# EAGLE design esp8266 - velky stabilizator (EAGLE 9.6.2)
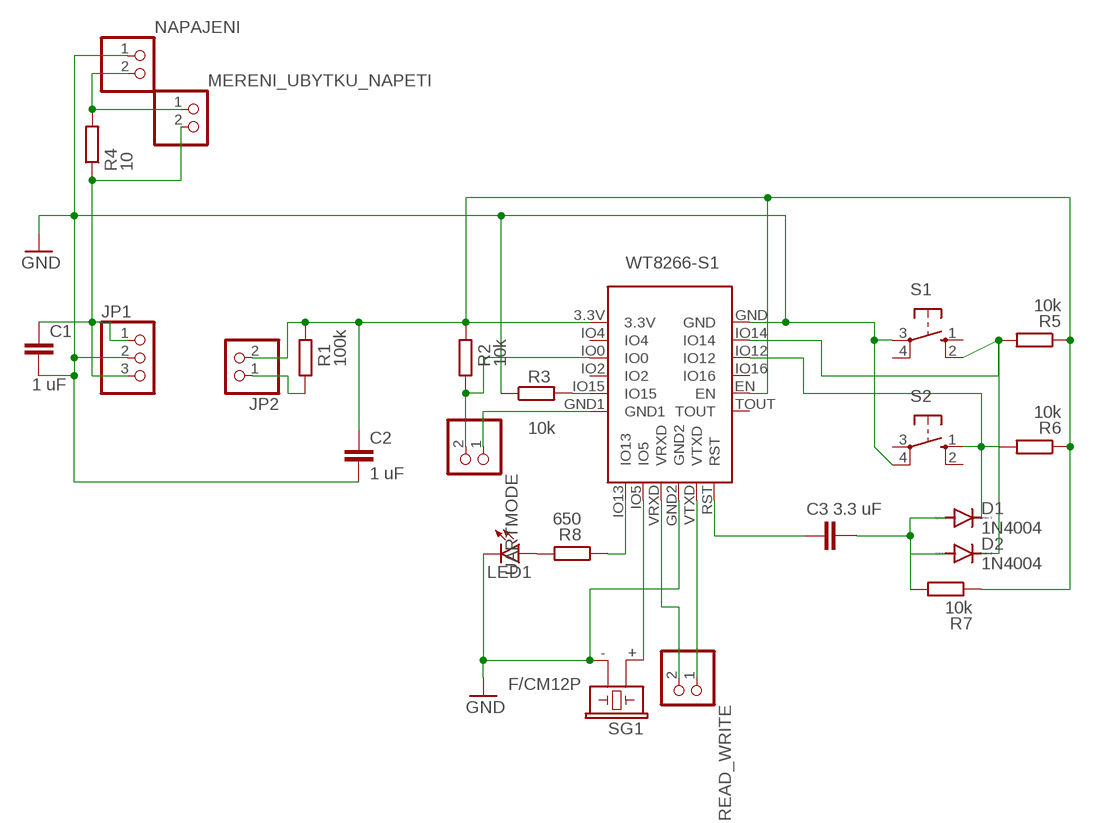
[diagram p0: schematic, sheet 1]

## Parts
C1  1 uF  C2.5/2  [C2.5-2]
C2  1 uF  C2.5/2  [C2.5-2]
C3  3.3 uF  C2.5/2  [C2.5-2]
D1  1N4004  [DO41-10]
D2  1N4004  [DO41-10]
JP1  PINHD-1X3  [1X03]
JP2  PINHD-1X2  [1X02]
LED1  LED5MM  [LED5MM]
MERENI_UBYTKU_NAPETI  PINHD-1X2  [1X02]
NAPAJENI  PINHD-1X2  [1X02]
R1  100k  R-EU_0207/10  [0207/10]
R2  10k  R-EU_0207/10  [0207/10]
R3  10k  R-EU_0207/10  [0207/10]
R4  10  R-EU_0207/10  [0207/10]
R5  10k  R-EU_0207/10  [0207/10]
R6  10k  R-EU_0207/10  [0207/10]
R7  10k  R-EU_0207/10  [0207/10]
R8  650  R-EU_0207/10  [0207/10]
READ_WRITE  PINHD-1X2  [1X02]
S1  10-XX  [B3F-10XX]
S2  10-XX  [B3F-10XX]
SG1  F/CM12P  [F/CM12P]
U$1  WT8266-S1  [WT8266-S1]
UARTMODE  PINHD-1X2  [1X02]

## Nets
GND: C1.2 C2.2 JP1.2 LED1.K(C) NAPAJENI.1 R3.1 S1.3(P) S2.4(P1) SG1.- U$1.GND U$1.GND2
N$1: C1.1 JP1.1 JP1.3 MERENI_UBYTKU_NAPETI.2 R4.1
N$2: C2.1 JP2.2 R1.2 R2.2 R5.1 R6.1 R7.1 U$1.3.3V U$1.EN
N$3: R2.1 U$1.IO0 UARTMODE.2
N$4: JP2.1 R1.1
N$5: READ_WRITE.2 U$1.VRXD
N$7: READ_WRITE.1 U$1.VTXD
N$8: U$1.GND1 UARTMODE.1
N$9: R3.2 U$1.IO15
N$10: MERENI_UBYTKU_NAPETI.1 NAPAJENI.2 R4.2
N$11: C3.1 U$1.RST
N$12: D1.C R6.2 S2.1(S) U$1.IO12
N$13: D2.C R5.2 S1.2(S1) U$1.IO14
N$14: C3.2 D1.A D2.A R7.2
N$15: R8.1 U$1.IO13
N$16: LED1.A R8.2
N$17: SG1.+ U$1.IO5
Unconnected: S1.1(S) S1.4(P1) S2.2(S1) S2.3(P) U$1.IO2 U$1.IO4 U$1.IO16 U$1.TOUT

## Library data of the parts
C1-C3 = capacitor-wima:C: CAPACITOR naming: grid - package width
D1 D2 = diode:1N4004: DIODE general purpose rectifier, 1 A
JP1 = pinhead:PINHD-1X3: PIN HEADER
JP2 MERENI_UBYTKU_NAPETI NAPAJENI READ_WRITE UARTMODE = pinhead:PINHD-1X2: PIN HEADER
LED1 = led:LED: LED OSRAM: - CHIPLED LG R971, LG N971, LY N971, LG Q971, LY Q971, LO R971, LY R971 LH N974, LH R974 LS Q976, LO Q976, LY Q976 LO Q996 - Hyper CHIPLED LW Q18S LB Q993, LB Q99A, LB R99A - SideLED LS A670, LO A670, LY A670, LG A670, LP A670 LB A673, LV A673, LT A673, LW A673 LH A674 LY A675 LS A676, LA A676, LO A676, LY A676, LW A676 LS A679, LY A679, LG A679 - Hyper Micro SIDELED® LS Y876, LA Y876, LO Y876, LY Y876 LT Y87S - SmartLED LW L88C, LW L88S LB L89C, LB L89S, LG L890 LS L89K, LO L89K, LY L89K LS L896, LA L896, LO L896, LY L896 - TOPLED LS T670, LO T670, LY T670, LG T670, LP T670 LSG T670, LSP T670, LSY T670, LOP T670, LYG T670 LG T671, LOG T671, LSG T671 LB T673, LV T673, LT T673, LW T673 LH T674 LS T676, LA T676, LO T676, LY T676, LB T676, LH T676, LSB T676, LW T676 LB T67C, LV T67C, LT T67C, LS T67K, LO T67K, LY T67K, LW E67C LS E67B, LA E67B, LO E67B, LY E67B, LB E67C, LV E67C, LT E67C LW T67C LS T679, LY T679, LG T679 LS T770, LO T770, LY T770, LG T770, LP T770 LB T773, LV T773, LT T773, LW T773 LH T774 LS E675, LA E675, LY E675, LS T675 LS T776, LA T776, LO T776, LY T776, LB T776 LHGB T686 LT T68C, LB T68C - Hyper Mini TOPLED® LB M676 - Mini TOPLED Santana® LG M470 LS M47K, LO M47K, LY M47K Source: http://www.osram.convergy.de LUXEON: - LUMILED® LXK2-PW12-R00, LXK2-PW12-S00, LXK2-PW14-U00, LXK2-PW14-V00 LXK2-PM12-R00, LXK2-PM12-S00, LXK2-PM14-U00 LXK2-PE12-Q00, LXK2-PE12-R00, LXK2-PE12-S00, LXK2-PE14-T00, LXK2-PE14-U00 LXK2-PB12-K00, LXK2-PB12-L00, LXK2-PB12-M00, LXK2-PB14-N00, LXK2-PB14-P00, LXK2-PB14-Q00 LXK2-PR12-L00, LXK2-PR12-M00, LXK2-PR14-Q00, LXK2-PR14-R00 LXK2-PD12-Q00, LXK2-PD12-R00, LXK2-PD12-S00 LXK2-PH12-R00, LXK2-PH12-S00 LXK2-PL12-P00, LXK2-PL12-Q00, LXK2-PL12-R00 Source: www.luxeon.com KINGBRIGHT: KA-3528ASYC Source: www.kingbright.com
R1-R8 = rcl:R-EU_: RESISTOR, European symbol; SPICEPREFIX: R
S1 S2 = switch-omron:10-XX: OMRON SWITCH; MPN: B3F-1000; OC_FARNELL: 176432; OC_NEWARK: 36M3542
SG1 = buzzer:F/CM12P: BUZZER Source: Buerklin; OC_FARNELL: unknown; OC_NEWARK: unknown
U$1 = WT8266:WT8266-S1

## Board
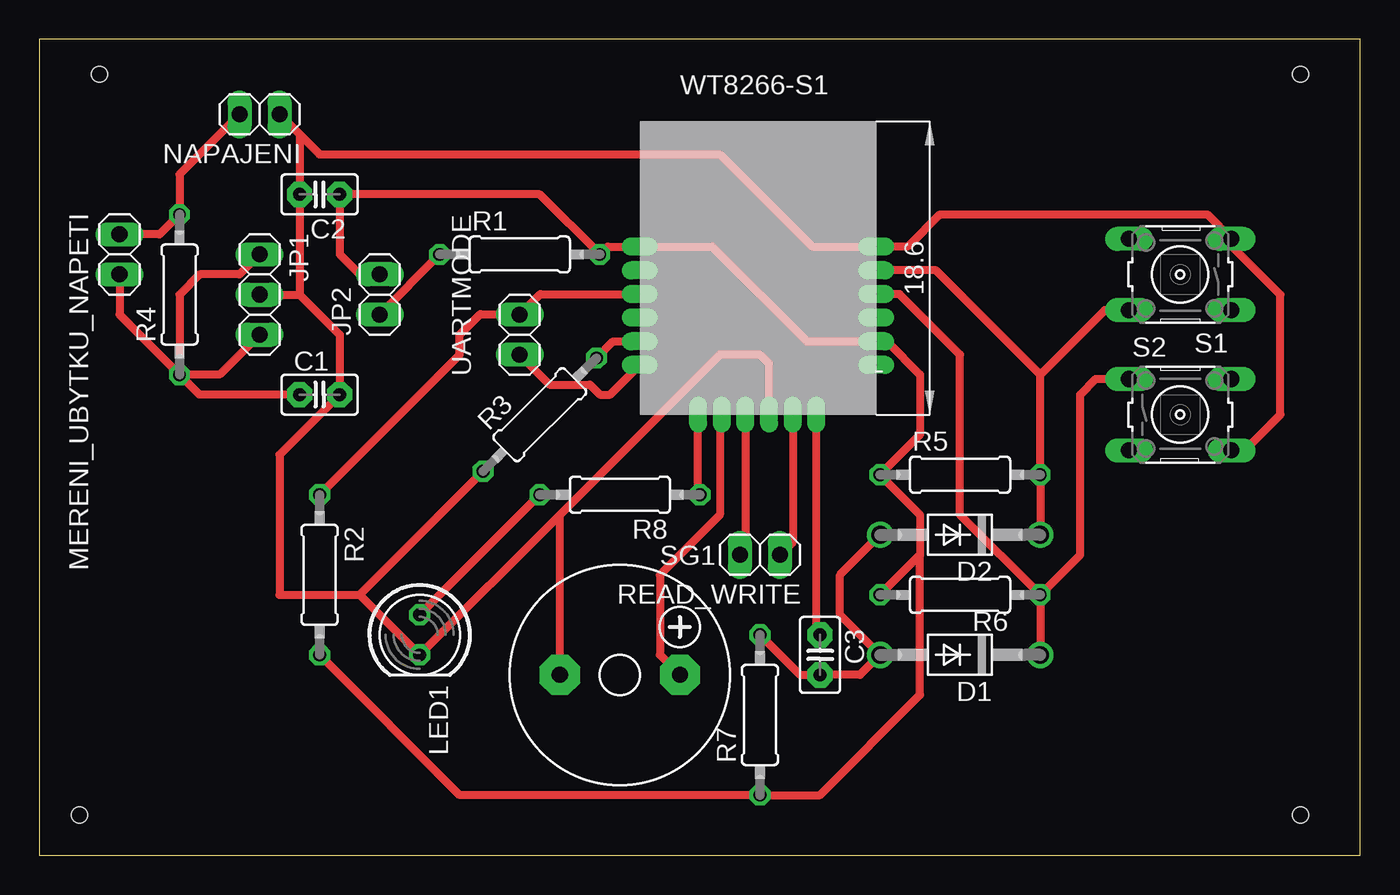
[diagram p1: board, top side]
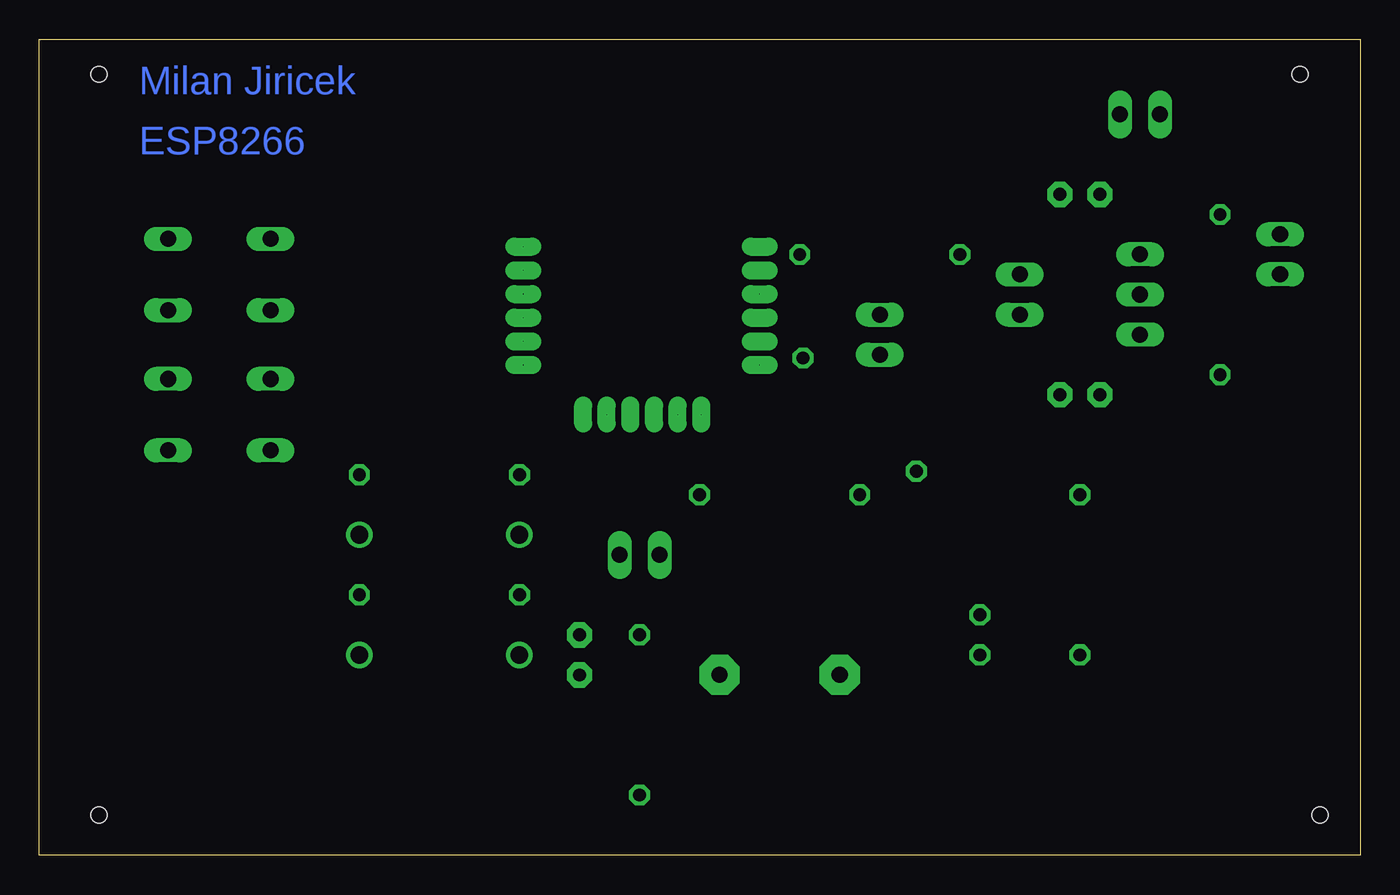
[diagram p2: board, bottom side, seen from below]

Size 83.8 x 51.74 mm. Coordinates in mm from the lower left corner, seen from the top.
Outline: 0,0 83.8,0 83.8,51.74 0,51.74 0,0
Copper layers (1*16): Top 0.035mm / dielectric 1.5mm / Bottom 0.035mm
Design rules "default": minimum track width 6mil, minimum drill 0.35mm, track to track 6mil, track to pad 6mil, pad to pad 6mil, via to via 6mil, smd to smd 6mil, copper to edge 40mil, drill to drill 6mil, minimum pad ring 10mil, minimum via ring 8mil, stop-mask expansion 4mil, vias tented up to drill 0mil, thermal gap 10mil
Holes 1 mm at 2.54,2.54 80.01,2.54 80.01,49.53 3.81,49.53

### Footprints (pad centres in the part's own frame; a part is rotated, then mirrored left to right if it is on the bottom)
C2.5-2 = drill 0.813 pad 1.6 octagon: 1 -1.27,0; 2 1.27,0
DO41-10 = drill 1.118: A 5.08,0; C -5.08,0
1X03 = drill 1.016 long: 1 -2.54,0; 2 0,0; 3 2.54,0
1X02 = drill 1.016 long: 1 -1.27,0; 2 1.27,0
LED5MM = drill 0.813 octagon: A -1.27,0; K 1.27,0
0207/10 = drill 0.813 octagon: 1 -5.08,0; 2 5.08,0
B3F-10XX = drill 1.016 long: 1 -3.251,2.261; 2 3.251,2.261; 3 -3.251,-2.261; 4 3.251,-2.261
F/CM12P = drill 1.016 pad 2.54 octagon: + 3.81,0; - -3.81,0
WT8266-S1 = drill 0.01 pad 1.143 long: 3.3V 0,10.65; EN 15,4.65; GND 15,10.65; GND1 0,3.15; GND2 8.2,0; IO0 0,7.65; IO2 0,6.15; IO4 0,9.15; IO5 5.2,0; IO12 15,7.65; IO13 3.7,0; IO14 15,9.15; IO15 0,4.65; IO16 15,6.15; RST 11.2,0; TOUT 15,3.15; VRXD 6.7,0; VTXD 9.7,0

### Placement (x,y rotation side)
C1  17.78,29.21 0 top
C2  17.78,41.91 180 top
C3  49.53,12.7 270 top
D1  58.42,12.7 180 top
D2  58.42,20.32 180 top
JP1  13.97,35.56 270 top
JP2  21.59,35.56 90 top
LED1  24.13,13.97 270 top
MERENI_UBYTKU_NAPETI  5.08,38.1 270 top
NAPAJENI  13.97,46.99 180 top
R1  30.48,38.1 0 top
R2  17.78,17.78 270 top
R3  31.75,27.94 45 top
R4  8.89,35.56 90 top
R5  58.42,24.13 0 top
R6  58.42,16.51 0 top
R7  45.72,8.89 90 top
R8  36.83,22.86 180 top
READ_WRITE  45.72,19.05 180 top
S1  72.39,36.83 180 top
S2  72.39,27.94 0 top
SG1  36.83,11.43 0 top
U$1  38.1,27.94 0 top
UARTMODE  30.48,33.02 90 top

### Tracks (layer width: path | path; a pad name or v marks a point on that pad's centre or on a via)
GND
  Top 0.508: S2.4 76.48,25.68 78.74,27.94 78.74,35.56 75.64,38.66 S1.3 74.09,40.64 57.15,40.64 55.1,38.59 U$1.GND 49.04,38.59 43.18,44.45 17.78,44.45 NAPAJENI.1 16.51,45.72 C2.2 16.51,35.56 | 20.32,16.51 15.24,16.51 15.24,25.4 C1.2 19.05,33.02 16.51,35.56 | R3.1 20.32,16.51 | JP1.2 16.51,35.56 | SG1.- 33.02,21.59 | 33.02,21.59 LED1.K 20.32,16.51 | U$1.GND2 46.3,31.17 45.72,31.75 43.18,31.75 33.02,21.59
N$1
  Top 0.508: R4.1 5.08,34.29 MERENI_UBYTKU_NAPETI.2 | C1.1 10.16,29.21 R4.1 | JP1.3 11.43,30.48 R4.1 | JP1.1 12.7,36.83 10.16,36.83 8.89,35.56 R4.1
N$2
  Top 0.508: 19.11,41.85 C2.1 | 55.88,19.05 R6.1 | 55.88,19.05 55.88,21.59 R5.1 55.88,26.67 55.88,30.48 53.77,32.59 U$1.EN 48.69,32.59 42.69,38.59 U$1.3.3V 36.05,38.59 R1.2 31.75,41.91 C2.1 | 55.88,19.05 55.88,10.16 49.53,3.81 R7.1 26.67,3.81 R2.2 | C2.1 19.05,38.1 20.32,36.83 JP2.2
N$3
  Top 0.508: R2.1 26.67,31.75 26.67,33.02 27.97,34.32 30.51,34.32 UARTMODE.2 31.78,35.59 U$1.IO0
N$4
  Top 0.508: JP2.1 R1.1
N$5
  Top 0.508: U$1.VRXD 44.8,19.4 READ_WRITE.2
N$7
  Top 0.508: U$1.VTXD 47.8,19.86 READ_WRITE.1
N$8
  Top 0.508: UARTMODE.1 32.38,29.84 | 32.38,29.84 32.41,29.82 | 32.38,29.84 34.92,29.84 35.56,29.21 36.22,29.21 U$1.GND1
N$9
  Top 0.508: 35.55,31.32 R3.2 36.4,32.59 U$1.IO15
N$10
  Top 0.508: NAPAJENI.2 8.89,43.18 R4.2 7.62,39.37 MERENI_UBYTKU_NAPETI.1
N$11
  Top 0.508: C3.1 49.3,14.2 U$1.RST
N$12
  Top 0.508: R6.2 D1.C | R6.2 58.42,21.59 58.42,31.75 54.58,35.59 U$1.IO12 | R6.2 66.04,19.05 66.04,29.21 67.03,30.2 S2.1
N$13
  Top 0.508: D2.C R5.2 63.5,30.48 | 63.5,30.48 67.59,34.57 S1.2 | U$1.IO14 56.89,37.09 63.5,30.48
N$14
  Top 0.508: R7.2 48.26,11.43 C3.2 52.07,11.43 D1.A 50.8,15.24 50.8,17.78 D2.A
N$15
  Top 0.508: R8.1 41.8,22.97 U$1.IO13
N$16
  Top 0.508: LED1.A R8.2
N$17
  Top 0.508: SG1.+ 39.37,12.7 39.37,17.78 43.18,21.59 43.18,27.82 U$1.IO5

### Text on the board
Bottom: Milan Jiricek | ESP8266